# EasyEDA Pro project ProPrj_PDB-F800GS_2025-04-13.epro, board PCB1
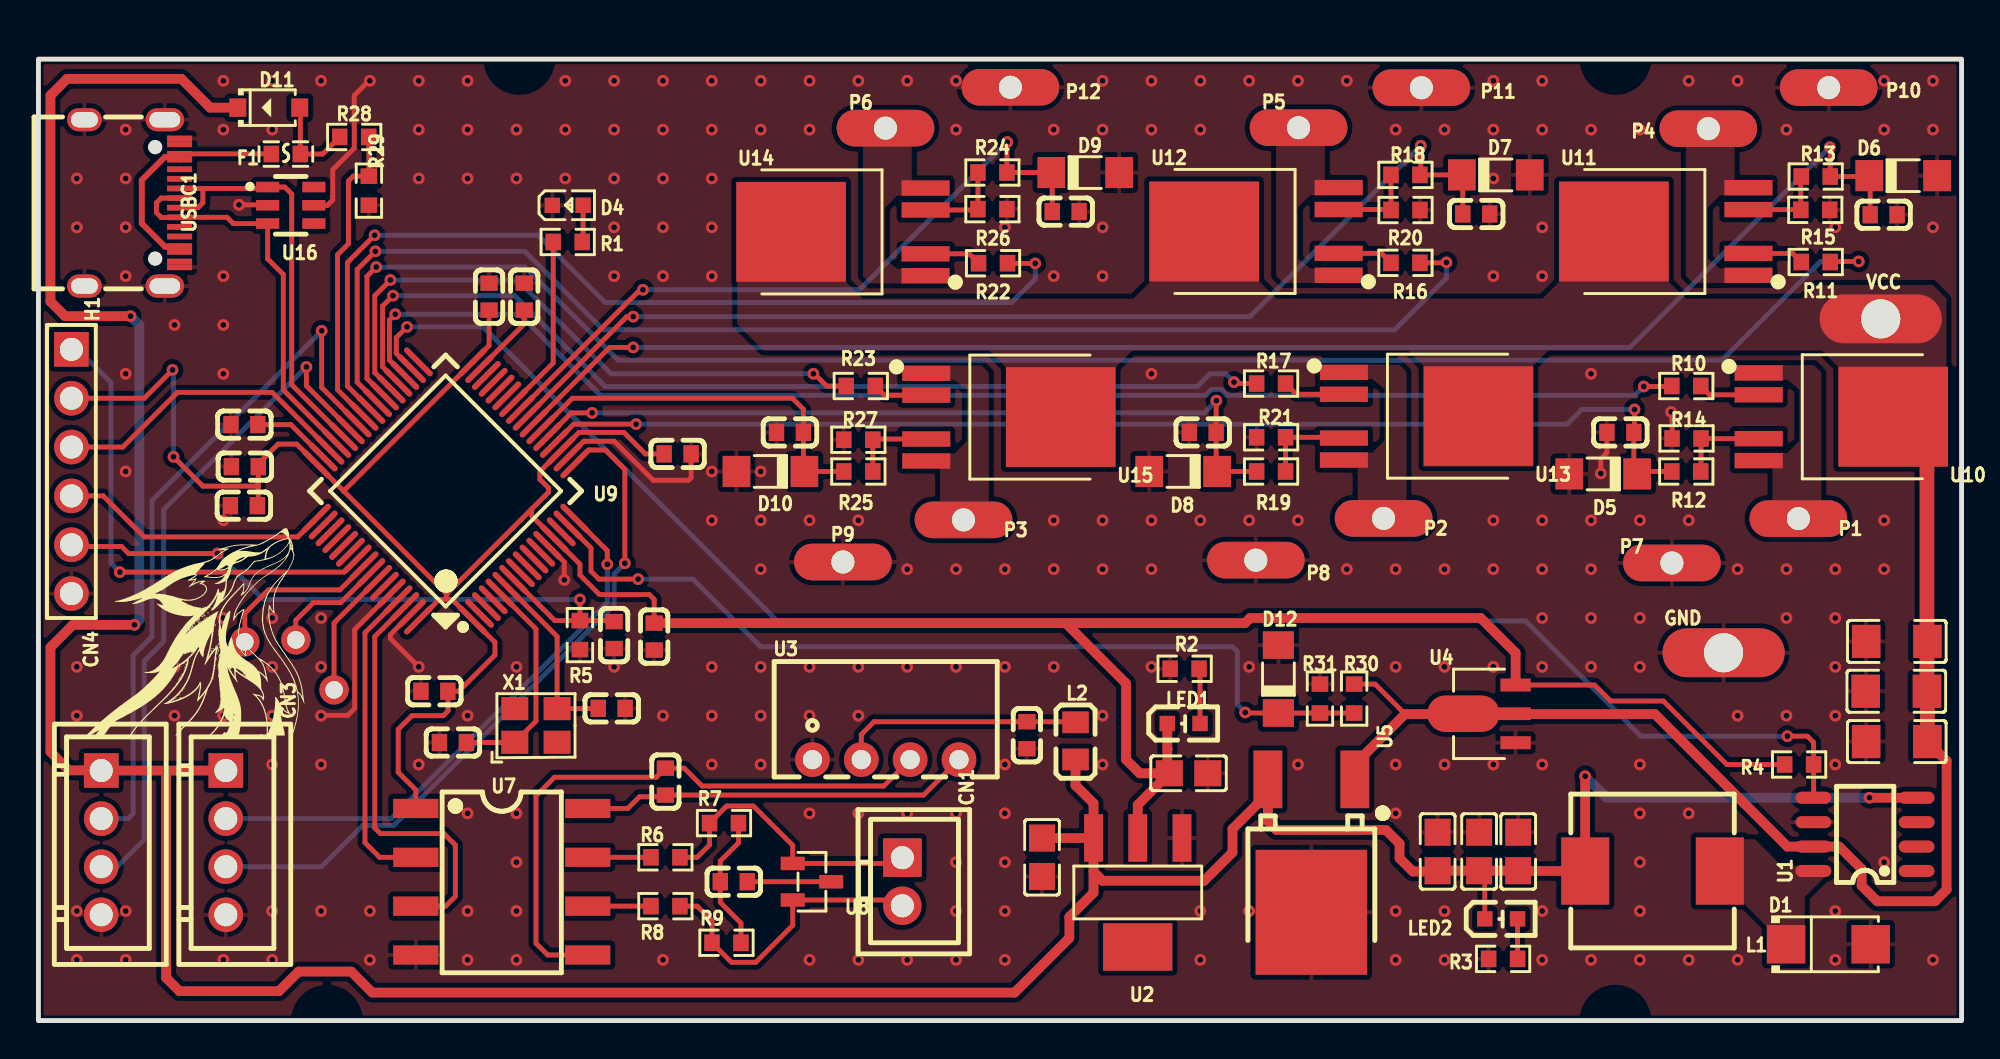
[diagram p3: board, top side]
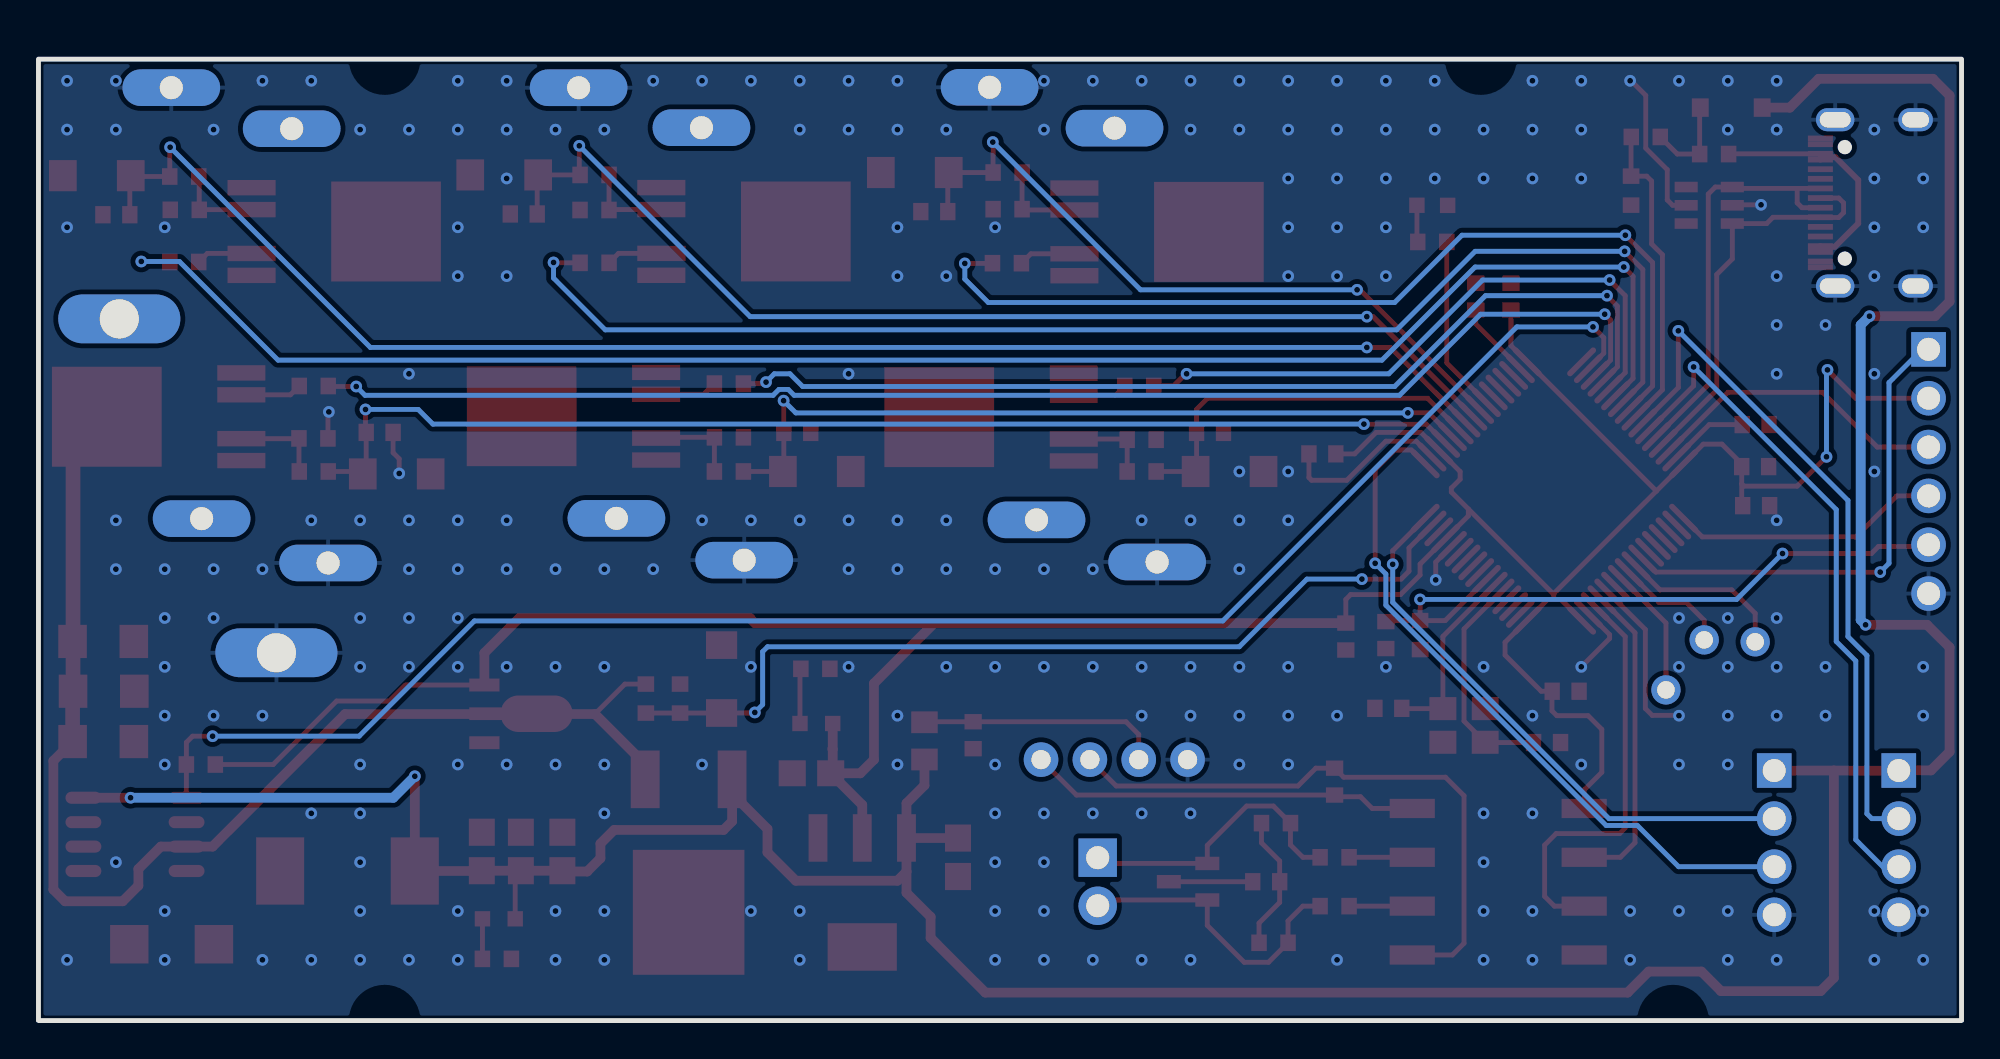
[diagram p4: board, bottom side, seen from below]

Outline 100 x 50 mm; copper layers: Top Layer, Bottom Layer. Coordinates in mm from the lower left corner of the outline.
Outline path: rectangle 0,50 100,0
Stack: Top Layer 0.035mm / Dielectric1 1.51mm FR4 er 4.5 / Bottom Layer 0.035mm

## Design rules (mm)
template: JLCPCB Capability(Two Layers Board)
spacing copperThickness1oz (default): track to track 0.102, other pairs 0.152 to 0.3
spacing copperThickness2oz: track to track 0.203, other pairs 0.152 to 0.3
track width copperThickness1oz (default): min 0.127, default 0.254, max 2.54
track width copperThickness2oz: min 0.203, default 0.254, max 2.54
differential pair differentialPair (default): width min 0.127, default 0.254, max 2.54; gap min 0.152, default 0.152
via viaSize (default): diameter min 0.5, default 0.61, max 10; hole min 0.3, default 0.305, max 6.3

## Placement (name value [footprint] x y rotation side)
C1  47uF  [C1206]  96.63 14.51 0 top
C2  47uF  [C0805]  76.95 8.79 270 top
C3  15pF  [C0603]  21.55 14.46 180 top
C4  47uF  [C0805]  74.91 8.79 270 top
C5  47uF  [C0805]  72.76 8.79 270 top
C6  47uF  [C1206]  96.61 17.13 0 top
C7  4.7uF  [C0603]  51.4 14.84 270 top
C8  4.7uF  [C0603]  32.6 12.43 270 top
C9  47uF  [C0805]  59.8 12.86 0 top
C10  47uF  [C0805]  52.18 8.49 90 top
C13  47uF  [C1206]  96.63 19.72 180 top
C14  15pF  [C0603]  29.81 16.24 0 top
C15  100nF  [C0603]  29.93 20.05 90 top
C16  2.2uF  [C0603]  10.71 30.99 180 top
C17  2.2uF  [C0603]  25.26 37.65 90 top
C18  100nF  [C0603]  36.16 7.22 0 top
C19  100nF  [C0603]  32.02 19.97 90 top
C20  100nF  [C0603]  10.68 26.78 0 top
C21  100nF  [C0603]  33.24 29.47 180 top
C22  100nF  [C0603]  10.73 28.81 0 top
C23  4.7uF  [C0603]  23.43 37.65 270 top
C24  1uF  [C0603]  20.59 17.13 0 top
C25  2.2pF  [C0603]  82.26 30.59 180 top
C26  2.2pF  [C0603]  95.95 41.91 0 top
C27  2.2pF  [C0603]  74.76 41.95 0 top
C28  2.2pF  [C0603]  60.54 30.59 180 top
C29  2.2pF  [C0603]  53.42 42.07 0 top
C30  2.2pF  [C0603]  39.08 30.59 180 top
CN1  XH-2A  [CONN-TH_XH-2A_C722856]  44.92 7.22 270 top
CN3  XH-4A  [CONN-TH_4P-P2.50_XH-4A]  9.74 9.25 270 top
CN4  XH-4A  [CONN-TH_4P-P2.50_XH-4A]  3.26 9.25 270 top
D1  SS34  [SMA_L4.3-W2.6-LS5.2-RD]  93.08 3.97 0 top
D4  XL-1608SURC-06  [LED0603-RD_RED]  27.52 42.4 0 top
D5  BZV55B3V3  [SOD-80_L3.5-W1.5-RD]  81.37 28.43 180 top
D6  BZV55B3V3  [SOD-80_L3.5-W1.5-RD]  96.97 43.94 0 top
D7  BZV55B3V3  [SOD-80_L3.5-W1.5-RD]  75.78 43.98 0 top
D8  BZV55B3V3  [SOD-80_L3.5-W1.5-RD]  59.53 28.56 180 top
D9  BZV55B3V3  [SOD-80_L3.5-W1.5-RD]  54.43 44.1 0 top
D10  BZV55B3V3  [SOD-80_L3.5-W1.5-RD]  38.06 28.56 180 top
D11  B5817W  [SOD-123_L2.7-W1.6-LS3.7-FD]  11.98 47.48 180 top
D12  BZV55B3V3  [SOD-80_L3.5-W1.5-RD]  64.48 17.76 90 top
F1  ASMD0603-020  [F0603]  12.86 45.07 180 top
GND  -  [Wire pad 2.54 x 6.35 footprint]  87.63 19.13 0 top
H1  2.54-1x6P直针  [HDR-TH_6P-P2.54-V-M-1]  1.71 28.56 270 top
L1  68uH  [IND-SMD_L8.5-W8.0_SMS0850]  83.93 7.78 180 top
L2  6.8uH  [L0805]  53.93 14.55 90 top
LED1  SZYY0603Y  [LED0603-R-RD_YELLOW]  59.55 15.45 0 top
LED2  SZYY0603Y  [LED0603-R-RD_YELLOW]  76.06 5.29 0 top
NOREF  -  [Pad_e208]  13.38 19.8 0 top
NOREF#2  -  [Pad_e216]  10.73 19.7 0 top
NOREF#3  -  [Pad_e213]  15.37 17.2 0 top
P1  -  [Wire pad 2x5 footprint]  91.52 26.1 180 top
P2  -  [Wire pad 2x5 footprint]  69.95 26.12 180 top
P3  -  [Wire pad 2x5 footprint]  48.1 26.04 180 top
P4  -  [Wire pad 2x5 footprint]  86.83 46.38 0 top
P5  -  [Wire pad 2x5 footprint]  65.52 46.44 0 top
P6  -  [Wire pad 2x5 footprint]  44.04 46.41 0 top
P7  -  [Wire pad 2x5 footprint]  84.94 23.8 180 top
P8  -  [Wire pad 2x5 footprint]  63.3 23.94 180 top
P9  -  [Wire pad 2x5 footprint]  41.83 23.85 180 top
P10  -  [Wire pad 2x5 footprint]  93.09 48.52 180 top
P11  -  [Wire pad 2x5 footprint]  71.91 48.51 180 top
P12  -  [Wire pad 2x5 footprint]  50.54 48.54 180 top
R1  4.7kΩ  [R0603]  27.52 40.49 180 top
R2  220Ω  [R0603]  59.6 18.29 0 top
R3  330Ω  [R0603]  76.16 3.21 0 top
R4  4.7kΩ  [R0603]  91.55 13.32 0 top
R5  10kΩ  [R0603]  28.16 20.05 90 top
R6  10Ω  [R0603]  32.6 8.49 0 top
R7  60.4Ω  [R0603]  35.65 10.27 0 top
R8  10Ω  [R0603]  32.6 5.95 0 top
R9  60.4Ω  [R0603]  35.78 4.04 0 top
R10  10kΩ  [R0603]  85.69 33 0 top
R11  10kΩ  [R0603]  92.42 39.45 180 top
R12  10kΩ  [R0603]  85.69 28.56 0 top
R13  10kΩ  [R0603]  92.42 43.9 180 top
R14  330Ω  [R0603]  85.7 30.28 0 top
R15  330Ω  [R0603]  92.39 42.16 180 top
R16  10kΩ  [R0603]  71.08 39.41 180 top
R17  10kΩ  [R0603]  64.1 33.13 0 top
R18  10kΩ  [R0603]  71.08 43.98 180 top
R19  10kΩ  [R0603]  64.1 28.56 0 top
R20  330Ω  [R0603]  71.09 42.16 180 top
R21  330Ω  [R0603]  64.1 30.33 0 top
R22  10kΩ  [R0603]  49.64 39.39 180 top
R23  10kΩ  [R0603]  42.76 33 0 top
R24  10kΩ  [R0603]  49.61 44.1 180 top
R25  10kΩ  [R0603]  42.63 28.56 0 top
R26  330Ω  [R0603]  49.61 42.2 180 top
R27  330Ω  [R0603]  42.63 30.21 0 top
R28  330Ω  [R0603]  16.42 45.95 0 top
R29  680Ω  [R0603]  17.18 43.16 270 top
R30  4.7kΩ  [R0603]  68.41 16.75 90 top
R31  1.3kΩ  [R0603]  66.64 16.75 270 top
U1  LM2594D-5.0RG  [SOP-8_L4.9-W3.9-P1.27-LS6.0-BL]  94.98 9.68 90 top
U2  AMS1117-3.3  [SOT-223-4_L6.5-W3.5-P2.30-LS7.0-BR]  57.16 6.66 90 top
U3  B0505S-1W  [PWRM-TH_BXXXXS-1WR3]  44.06 13.57 0 top
U4  HT7533-1  [SOT-89_L4.5-W2.5-P1.50-LS4.2-BR]  75.46 15.95 0 top
U5  CJ78M05  [TO-252-3_L6.5-W5.8-P4.58-TL]  66.19 9.09 270 top
U7  ISO1050DUBR  [SOIC-8_L9.3-W6.6-P2.54-LS10.4-BL]  24.09 7.22 270 top
U8  CDSOT23-SM712  [SOT-23-3_L2.9-W1.3-P0.95-LS2.4-BR]  40.22 7.22 180 top
U9  STM32F405RGT6  [LQFP-64_L10.0-W10.0-P0.50-LS12.0-BL]  21.17 27.54 45 top
U10  BTS6143D  [TO-252-5_L6.5-W6.1-P1.14-LS10.0-BR]  92.95 31.4 180 top
U11  BTS6143D  [TO-252-5_L6.5-W6.1-P1.14-LS10.0-BR]  85.42 41.04 0 top
U12  BTS6143D  [TO-252-5_L6.5-W6.1-P1.14-LS10.0-BR]  64.11 41.04 0 top
U13  BTS6143D  [TO-252-5_L6.5-W6.1-P1.14-LS10.0-BR]  71.38 31.43 180 top
U14  BTS6143D  [TO-252-5_L6.5-W6.1-P1.14-LS10.0-BR]  42.63 41.02 0 top
U15  BTS6143D  [TO-252-5_L6.5-W6.1-P1.14-LS10.0-BR]  49.66 31.38 180 top
U16  TPESDA6V1BC6  [TSOT-23-6_L2.9-W1.6-P0.95-LS2.8-BL]  13.12 42.4 270 top
USBC1  TYPE-C-31-M-12  [USB-C_SMD-TYPE-C-31-M-12]  4.86 42.53 270 top
VCC  -  [Wire pad 2.54 x 6.35 footprint]  95.8 36.49 0 top
X1  8MHz  [OSC-SMD_4P-L3.2-W2.5-BL]  25.87 15.35 0 top

## Footprints (pads in the part's own frame, mm; a bottom-side part is the same pattern mirrored in y, then rotated)
C0603
  rect 0.8x0.9 smd: 1(-0.7,0) 2(0.7,0)
C0805
  rect 1.41x1.35 smd: 1(-1,0) 2(1,0)
C1206
  rect 1.485x1.728 smd: 1(-1.593,0) 2(1.593,0)
CONN-TH_4P-P2.50_XH-4A
  rect 1.8x1.8 hole 1.199: 1(-3.751,0)
  round 1.8 hole 1.199: 2(-1.25,0) 3(1.25,0) 4(3.751,0)
CONN-TH_XH-2A_C722856
  rect 2x2 hole 1.2: 1(-1.25,0)
  round 2 hole 1.2: 2(1.25,0)
F0603
  rect 0.806x0.864 smd: 1(-0.753,0) 2(0.753,0)
HDR-TH_6P-P2.54-V-M-1
  rect 1.8x1.8 hole 1.2x0.9: 1(-6.35,0)
  round 1.8 hole 1.2x0.9: 2(-3.81,0) 3(-1.27,0) 4(1.27,0) 5(3.81,0) 6(6.35,0)
IND-SMD_L8.5-W8.0_SMS0850
  rect 2.5x3.5 smd: 1(-3.5,0) 2(3.5,0)
L0805
  rect 1.133x1.377 smd: 1(-0.966,0) 2(0.966,0)
LED0603-R-RD_YELLOW
  rect 0.8x0.8 smd: 1(0.851,0) 2(-0.851,0)
LED0603-RD_RED
  rect 0.8x0.8 smd: 1(-0.799,-0.004) 2(0.799,0.004)
LQFP-64_L10.0-W10.0-P0.50-LS12.0-BL
  oval 0.3x2 smd: 1(-3.75,-5.75) 2(-3.25,-5.75) 3(-2.75,-5.75) 4(-2.25,-5.75) 5(-1.75,-5.75) 6(-1.25,-5.75) 7(-0.75,-5.75) 8(-0.25,-5.75) 9(0.25,-5.75) 10(0.75,-5.75) 11(1.25,-5.75) 12(1.75,-5.75) 13(2.25,-5.75) 14(2.75,-5.75) 15(3.25,-5.75) 16(3.75,-5.75) 33(3.75,5.75) 34(3.25,5.75) 35(2.75,5.75) 36(2.25,5.75) 37(1.75,5.75) 38(1.25,5.75) 39(0.75,5.75) 40(0.25,5.75) 41(-0.25,5.75) 42(-0.75,5.75) 43(-1.25,5.75) 44(-1.75,5.75) 45(-2.25,5.75) 46(-2.75,5.75) 47(-3.25,5.75) 48(-3.75,5.75)
  oval 2x0.3 smd: 17(5.75,-3.75) 18(5.75,-3.25) 19(5.75,-2.75) 20(5.75,-2.25) 21(5.75,-1.75) 22(5.75,-1.25) 23(5.75,-0.75) 24(5.75,-0.25) 25(5.75,0.25) 26(5.75,0.75) 27(5.75,1.25) 28(5.75,1.75) 29(5.75,2.25) 30(5.75,2.75) 31(5.75,3.25) 32(5.75,3.75) 49(-5.75,3.75) 50(-5.75,3.25) 51(-5.75,2.75) 52(-5.75,2.25) 53(-5.75,1.75) 54(-5.75,1.25) 55(-5.75,0.75) 56(-5.75,0.25) 57(-5.75,-0.25) 58(-5.75,-0.75) 59(-5.75,-1.25) 60(-5.75,-1.75) 61(-5.75,-2.25) 62(-5.75,-2.75) 63(-5.75,-3.25) 64(-5.75,-3.75)
OSC-SMD_4P-L3.2-W2.5-BL
  rect 1.4x1.2 smd: 1(-1.1,-0.875) 2(1.1,-0.875) 3(1.1,0.875) 4(-1.1,0.875)
Pad_e208
  round 1.524 hole 0.914: 1(0,0)
Pad_e213
  round 1.524 hole 0.914: 2(0,0)
Pad_e216
  round 1.524 hole 0.914: 3(0,0)
PWRM-TH_BXXXXS-1WR3
  round 1.8 hole 1: 1(-3.81,0) 2(-1.27,0) 3(1.27,0) 4(3.81,0)
R0603
  rect 0.806x0.864 smd: 1(-0.753,0) 2(0.753,0)
SMA_L4.3-W2.6-LS5.2-RD
  rect 2x2 smd: 1(-2.2,0) 2(2.2,0)
SOD-80_L3.5-W1.5-RD
  rect 1.44x1.62 smd: 1(-1.765,0) 2(1.765,0)
SOD-123_L2.7-W1.6-LS3.7-FD
  rect 0.88x0.96 smd: 1(-1.61,0) 2(1.61,0)
SOIC-8_L9.3-W6.6-P2.54-LS10.4-BL
  rect 1x2.35 smd: 1(-3.81,-4.471) 2(-1.27,-4.471) 3(1.27,-4.471) 4(3.81,-4.471) 5(3.81,4.471) 6(1.27,4.471) 7(-1.27,4.471) 8(-3.81,4.471)
SOP-8_L4.9-W3.9-P1.27-LS6.0-BL
  oval 0.63x1.865 smd: 1(-1.905,-2.683) 2(-0.635,-2.683) 3(0.635,-2.683) 4(1.905,-2.683) 5(1.905,2.683) 6(0.635,2.683) 7(-0.635,2.683) 8(-1.905,2.683)
SOT-23-3_L2.9-W1.3-P0.95-LS2.4-BR
  rect 1.25x0.7 smd: 1(1,-0.95) 2(1,0.95) 3(-1,0)
SOT-89_L4.5-W2.5-P1.50-LS4.2-BR
  rect 1.575x0.672 smd: 1(1.356,-1.5) 3(1.356,1.5)
  custom 5.377x1.9 smd: 2(-1.356,0.009)
SOT-223-4_L6.5-W3.5-P2.30-LS7.0-BR
  rect 2.47x0.98 smd: 1(2.835,-2.3) 2(2.835,0) 3(2.835,2.3)
  rect 2.47x3.6 smd: 4(-2.835,0)
TO-252-3_L6.5-W5.8-P4.58-TL
  rect 3x1.5 smd: 1(-3.457,2.26) 3(-3.457,-2.26)
  rect 6.5x5.8 smd: 2(3.457,0)
TO-252-5_L6.5-W6.1-P1.14-LS10.0-BR
  rect 2.5x0.8 smd: 1(3.497,-2.28) 2(3.497,-1.14) 4(3.497,1.14) 5(3.497,2.28)
  rect 5.704x5.2 smd: 6(-3.497,0)
TSOT-23-6_L2.9-W1.6-P0.95-LS2.8-BL
  rect 0.55x1.2 smd: 1(-0.95,-1.2) 2(0,-1.2) 3(0.95,-1.2) 4(0.95,1.2) 5(0,1.2) 6(-0.95,1.2)
USB-C_SMD-TYPE-C-31-M-12
  oval 1.2x2 hole 0.8x1.6: 0(-4.325,1.706) 1(4.325,1.706)
  oval 1.2x1.8 hole 0.8x1.4: 2(4.325,-2.474) 3(-4.325,-2.474)
  rect 0.3x1.3 smd: A1(-3.35,2.474) A4(-2.55,2.474) A5(-1.25,2.474) A6(-0.25,2.474) A7(0.25,2.474) A8(1.25,2.474) A9(2.55,2.474) A12(3.35,2.474) B1(3.05,2.474) B4(2.25,2.474) B5(1.75,2.474) B6(0.75,2.474) B7(-0.75,2.474) B8(-1.75,2.474) B9(-2.25,2.474) B12(-3.05,2.474)
Wire pad 2.54 x 6.35 footprint
  oval 6.35x2.54 hole 2.032x1.905: 1(0,0)
Wire pad 2x5 footprint
  oval 5.08x1.905 hole 1.2: 1(0,0)

## Nets
As in the schematic, except:
+3V3: C9.1 C19.2 C20.2 C21.2 C22.2 C23.2 C24.2 H1.2 LED1.2 R4.1 U2.2 U4.3 U7.1 U9.1 U9.13 U9.19 U9.32 U9.48 U9.64

Pads without a net: NOREF 1; NOREF#2 3; NOREF#3 2; U1 1 2 3; U2 4; U9 2 3 4 8 9 10 11 14 27 28 29 30 33 50 51 52 53 54 56 57 58 59; U16 4 6; USBC1 A5 A8 B5 B8; X1 2 4

## Via types
v1: diameter 0.61, hole 0.305, Top Layer to Bottom Layer, 284 vias

## Routing (per net, layer and track width the routed paths; a pad name or vN(x,y) marks a point on that pad's centre or on a via; arc(x,y) is an arc through that point)
+3V3: length 168.6
  Top Layer w0.254: 25.65,26.61 26.53,27.49 26.53,27.69 26.07,28.15 26.07,28.55 27.18,29.66 28.11,30.59 30.44,30.59 31.56,29.47 C21.2 ; 25.65,26.61 25.65,26.25 26.83,25.06 28.16,23.74 28.16,23.17 29.17,22.16 31.76,22.16 32.02,21.9 C19.2 ; 25.65,26.61 21.21,22.17 ; 15.87,27.54 21.21,22.2 21.21,22.17 ; 15.87,27.54 U9.48 13.43,29.98 12.46,29.98 11.43,28.95 C22.2 11.43,27.91 ; 15.87,27.54 15.87,27.54 22.58,34.26 23.43,35.1 23.43,36.49 ; 11.43,27.91 11.43,26.83 C20.2 ; 11.43,27.91 11.32,27.79 8.55,27.79 v1(7.02,29.32) ; H1.2 5.5,32.37 v1(6.97,33.84) ; U4.3 80.92,17.45 81.75,16.62 84.49,16.62 87.79,13.32 R4.1 ; 21.21,22.17 21.21,21.9 ; U7.1 19.62,12 18.71,12.91 18.71,15.14 19.42,15.86 21.04,15.86 21.3,16.11 21.3,17.11 C24.2 21.86,17.13 23.74,19.01 23.74,19.67 21.51,21.9 21.21,21.9 ; U9.64 20.84,21.9 21.21,21.9
  Top Layer w0.508: 58.7,14.11 58.72,14.13 ; 58.7,14.11 58.7,12.96 C9.1 ; 58.7,14.11 LED1.2 ; U4.3 76.81,19.12 74.99,20.94 63,20.94 62.74,20.67 53.41,20.67 ; C9.1 57.16,11.22 U2.2 ; C9.1 57.26,12.86 56.55,13.57 56.55,17.53 53.41,20.67 ; 53.41,20.67 C19.2
  Bottom Layer w0.254: v1(6.97,33.84) 7.02,33.79 v1(7.02,29.32)
+5V: length 192.4
  Top Layer w0.254: LED2.2 75.21,7.5 C4.2
  Top Layer w0.508: 63.93,11.8 63.93,10.36 64.38,9.91 70.07,9.91 70.78,9.2 70.78,8.44 71.47,7.75 72.71,7.75 C5.2 C4.2 C2.2 76.96,7.78 L1.2 80.43,7.78 v1(80.43,12.71) ; 63.93,11.8 62.09,9.96 62.09,8.74 60.62,7.27 55.33,7.27 54.86,7.74 ; 63.93,11.8 U5.3 ; U1.4 v1(95.21,11.59) ; 53.93,13.58 53.93,12.23 54.86,11.3 U2.3 ; 6.64,13 CN3.1 ; 6.64,13 CN4.1 3.25,13.01 1.59,13.01 0.62,13.98 0.62,19.41 1.79,20.58 v1(4.99,20.58) ; 6.64,13 6.64,2.22 7.33,1.53 12.51,1.53 13.53,2.55 16.27,2.55 17.36,1.45 50.76,1.45 53.61,4.3 53.61,5.39 54.86,6.65 54.86,7.74 ; C10.2 54.86,9.49 U2.3 ; 54.86,7.74 U2.3 ; v1(4.79,36.63) 1.38,36.63 0.62,37.39 0.62,48.11 1.49,48.98 7.43,48.98 8.93,47.48 D11.2
  Bottom Layer w0.508: v1(4.79,36.63) 5.25,36.18 5.25,20.83 v1(4.99,20.58) ; v1(95.21,11.59) 81.55,11.59 v1(80.43,12.71)
+5V_ISOL: length 20.4
  Top Layer w0.254: U3.4 46.02,11.73 C8.2 32.51,11.64 31.25,11.64 30.65,11.03 U7.8
GND: length 36.9
  Top Layer w0.254: U16.2 11.89,42.42 v1(10.43,42.42) ; C21.1 33.94,28.24 33.79,28.1 31.97,28.1 29.93,30.13 28.36,30.13 27.53,29.31 ; C25.2 81.56,29.53 81.24,29.22 v1(81.24,28.45) ; R14.1 84.95,31.61 v1(84.9,31.66) ; v1(19.77,18.4) 18.3,19.87 18.3,20.07 U9.63 ; U16.5 15.02,42.4 15.3,42.68 15.3,44.25 16.42,45.37 16.42,48.11 17.18,48.88 v1(17.23,48.88) ; v1(27.34,22.92) 27.34,23.84 U9.12 ; v1(14.69,15.86) 14.71,15.87 16.08,15.87 16.44,16.23 16.44,20.34 18.34,22.24
  vias: v1(1.99,43.8) v1(1.99,41.26) v1(1.99,18.4) v1(1.99,15.86) v1(1.99,5.7) v1(1.99,3.16) v1(4.53,46.34) v1(4.53,43.8) v1(4.53,41.26) v1(4.53,38.72) v1(4.53,33.64) v1(4.53,28.56) v1(4.53,5.7) v1(4.53,3.16) v1(7.07,36.18) v1(7.07,18.4) v1(7.07,15.86) v1(9.61,48.88) v1(9.61,46.34) v1(9.61,38.72) v1(9.61,36.18) v1(9.61,33.64) v1(9.61,26.02) v1(9.61,20.94) v1(9.61,18.4) v1(9.61,15.86) v1(9.61,3.16) v1(12.15,48.88) v1(12.15,46.34) v1(12.15,20.94) v1(12.15,18.4) v1(12.15,15.86) v1(12.15,13.32) v1(12.15,5.7) v1(12.15,3.16) v1(14.69,48.88) v1(14.69,20.94) v1(14.69,18.4) v1(14.69,13.32) v1(14.69,5.7) v1(17.23,5.7) v1(17.23,3.16) v1(19.77,48.88) v1(19.77,46.34) v1(19.77,43.8) v1(19.77,13.32) v1(22.31,48.88) v1(22.31,46.34) v1(22.31,43.8) v1(22.31,15.86) v1(22.31,10.78) v1(22.31,5.7) v1(22.31,3.16) v1(24.85,46.34) v1(24.85,43.8) v1(24.85,18.4) v1(24.85,10.78) v1(24.85,8.24) v1(24.85,5.7) v1(24.85,3.16) v1(27.39,48.88) v1(27.39,46.34) v1(27.39,43.8) v1(29.93,48.88) v1(29.93,46.34) v1(29.93,43.8) v1(29.93,41.26) v1(29.93,38.72) v1(29.93,18.4) v1(32.47,48.88) v1(32.47,46.34) v1(32.47,43.8) v1(32.47,41.26) v1(32.47,38.72) v1(32.47,15.86) v1(32.47,3.16) v1(35.01,48.88) v1(35.01,46.34) v1(35.01,43.8) v1(35.01,41.26) v1(35.01,38.72) v1(35.01,28.56) v1(35.01,26.02) v1(35.01,18.4) v1(35.01,15.86) v1(35.01,13.32) v1(37.55,48.88) v1(37.55,46.34) v1(37.55,28.56) v1(37.55,26.02) v1(37.55,23.48) v1(37.55,18.4) v1(37.55,15.86) v1(37.55,13.32) v1(40.09,48.88) v1(40.09,46.34) v1(40.09,26.02) v1(40.09,18.4) v1(40.09,15.86) v1(40.09,10.78) v1(40.09,3.16) v1(42.63,48.88) v1(42.63,26.02) v1(42.63,18.4) v1(42.63,15.86) v1(42.63,10.78) v1(42.63,3.16) v1(45.17,48.88) v1(45.17,23.48) v1(45.17,18.4) v1(45.17,10.78) v1(45.17,3.16) v1(47.71,48.88) v1(47.71,46.34) v1(47.71,23.48) v1(47.71,18.4) v1(47.71,10.78) v1(47.71,8.24) v1(47.71,5.7) v1(47.71,3.16) v1(50.25,41.26) v1(50.25,23.48) v1(50.25,18.4) v1(50.25,13.32) v1(50.25,10.78) v1(50.25,8.24) v1(50.25,5.7) v1(50.25,3.16) v1(52.79,46.34) v1(52.79,38.72) v1(52.79,26.02) v1(52.79,23.48) v1(52.79,18.4) v1(55.33,48.88) v1(55.33,46.34) v1(55.33,41.26) v1(55.33,38.72) v1(55.33,26.02) v1(55.33,23.48) v1(55.33,15.86) v1(55.33,13.32) v1(57.87,48.88) v1(57.87,46.34) v1(57.87,33.64) v1(57.87,26.02) v1(57.87,23.48) v1(57.87,18.4) v1(60.41,48.88) v1(60.41,46.34) v1(60.41,26.02) v1(60.41,5.7) v1(60.41,3.16) v1(62.95,48.88) v1(62.95,26.02) v1(62.95,18.4) v1(62.95,5.7) v1(65.49,48.88) v1(65.49,26.02) v1(65.49,13.32) v1(68.03,48.88) v1(68.03,23.48) v1(70.57,46.34) v1(70.57,23.48) v1(70.57,18.4) v1(70.57,13.32) v1(70.57,10.78) v1(70.57,5.7) v1(70.57,3.16) v1(73.11,46.34) v1(73.11,23.48) v1(73.11,18.4) v1(73.11,13.32) v1(73.11,5.7) v1(73.11,3.16) v1(75.65,48.88) v1(75.65,46.34) v1(75.65,43.8) v1(75.65,38.72) v1(75.65,26.02) v1(75.65,23.48) v1(75.65,18.4) v1(75.65,13.32) v1(78.19,48.88) v1(78.19,46.34) v1(78.19,41.26) v1(78.19,38.72) v1(78.19,26.02) v1(78.19,23.48) v1(78.19,20.94) v1(78.19,18.4) v1(78.19,13.32) v1(78.19,5.7) v1(78.19,3.16) v1(80.73,46.34) v1(80.73,33.64) v1(80.73,26.02) v1(80.73,23.48) v1(80.73,20.94) v1(80.73,18.4) v1(80.73,3.16) v1(83.27,46.34) v1(83.27,26.02) v1(83.27,20.94) v1(83.27,18.4) v1(83.27,13.32) v1(83.27,10.78) v1(83.27,8.24) v1(83.27,5.7) v1(83.27,3.16) v1(85.81,48.88) v1(85.81,26.02) v1(85.81,10.78) v1(85.81,3.16) v1(88.35,48.88) v1(88.35,23.48) v1(88.35,15.86) v1(88.35,3.16) v1(90.89,46.34) v1(90.89,23.48) v1(90.89,20.94) v1(90.89,15.86) v1(93.43,41.26) v1(93.43,23.48) v1(93.43,20.94) v1(93.43,18.4) v1(93.43,15.86) v1(93.43,13.32) v1(93.43,5.7) v1(93.43,3.16) v1(95.97,48.88) v1(95.97,46.34) v1(95.97,26.02) v1(95.97,23.48) v1(95.97,8.24) v1(98.51,48.88) v1(98.51,46.34) v1(98.51,41.26) v1(98.51,3.16)
GND_ISOL2: length 4.4
  Top Layer w0.254: C18.2 41.09,7.22 41.22,7.09
PGND: length 31.6
  Top Layer w0.254: U3.3 43.96,12.2 34.51,12.2 33.58,13.13 C8.1 32.13,12.66 26.83,12.66 25.87,11.69 25.87,4.02 26.48,3.41 U7.5
VCC: length 66.5
  Top Layer w0.254: R30.2 69.51,17.5 71.06,15.94
  Top Layer w0.508: C1.2 99.22,13.51 99.22,6.81 98.62,6.2 95.62,6.2 94.81,7.02 94.81,7.88 93.64,9.05 U1.7 90.95,9.05 84.05,15.94 71.06,15.94 68.45,13.33 U5.1
  Top Layer w0.762: 96.45,31.4 98.2,29.65 C6.2 98.22,17.1 C1.2
(no net): length 21.3
  Top Layer w0.254: U9.58 15.37,20.68 NOREF#3.2 ; U9.57 15.72,21.74 14.3,21.74 13.38,20.82 NOREF.1 ; NOREF#2.3 10.73,21.17 11.95,22.4 15.68,22.4 16.93,23.65
ADC_VCC: length 47.3
  Top Layer w0.254: v1(31.18,22.96) 29.14,22.96 28.73,23.37 28.73,24.57 27.53,25.77 ; R30.1 R31.2 64.48,15.99 D12.1 62.78,16 v1(62.75,16.02)
  Bottom Layer w0.254: v1(31.18,22.96) 34.04,22.96 37.56,19.44 62.09,19.44 62.34,19.19 62.34,16.43 v1(62.75,16.02)
CAN1_H: length 15.2
  Top Layer w0.254: 44.92,8.34 44.75,8.17 U8.1 39.22,9.11 37.17,11.16 35.78,11.16 R7.1 34.9,9.13 34.25,8.49 R6.2
CAN1_L: length 15.6
  Top Layer w0.254: R8.2 34.25,5.95 35.02,5.18 R9.1 36.04,3.03 37.3,3.03 39.22,4.95 39.22,6.14 ; 44.92,5.84 44.49,6.27 U8.2
CAN1_RX: length 16.3
  Top Layer w0.254: U9.61 16.98,20.17 16.98,9.25 17.74,8.49 U7.2
CAN1_TX: length 21.7
  Top Layer w0.254: U7.3 21.17,5.95 21.68,6.46 21.68,9.12 21.08,9.73 17.78,9.73 17.49,10.01 17.49,19.97 U9.62
F_SWCLK: length 14.1
  Top Layer w0.254: U9.49 13.48,25.15 5.5,25.15 3.37,27.29 1.61,27.29
F_SWDIO: length 16
  Top Layer w0.254: 15.16,29.66 12.15,32.67 7.23,32.67 4.38,29.83 1.61,29.83
F_SWO: length 25.5
  Top Layer w0.254: v1(4.23,23.32) 15.89,23.32 16.58,24
  Bottom Layer w0.254: v1(4.23,23.32) 3.77,23.78 3.77,33.18 2.05,34.91 1.61,34.91
IN_1: length 72.2
  Top Layer w0.254: v1(18.56,36.73) 18.25,36.43 18.25,34.35 U9.35 ; v1(83.48,32.98) 84.91,32.98 R10.1
  Bottom Layer w0.254: v1(18.56,36.73) 25.01,36.73 29.22,32.52 60.71,32.52 61.01,32.82 61.49,32.82 61.8,32.52 83.02,32.52 v1(83.48,32.98)
IN_2: length 52.4
  Top Layer w0.254: U9.36 17.89,34 17.89,37.16 v1(18.44,37.7) ; R17.1 62.24,33.13 v1(62.17,33.2)
  Bottom Layer w0.254: v1(18.44,37.7) 24.75,37.7 29.48,32.98 60.26,32.98 60.92,33.64 61.74,33.64 v1(62.17,33.2)
IN_3: length 32.4
  Top Layer w0.254: 18.34,32.84 17.49,33.7 17.49,37.7 v1(18.3,38.51) ; R23.1 40.98,33 40.35,33.64 v1(40.3,33.64)
  Bottom Layer w0.254: v1(40.3,33.64) 29.78,33.64 24.91,38.51 v1(18.3,38.51)
IN_4: length 90
  Top Layer w0.254: v1(94.65,39.48) 93.2,39.48 R11.1 ; v1(17.56,39.19) 17.08,38.71 17.08,33.4 17.99,32.49
  Bottom Layer w0.254: v1(94.65,39.48) 92.67,39.48 87.54,34.35 30.14,34.35 25.3,39.19 v1(17.56,39.19)
IN_5: length 69.4
  Top Layer w0.254: U9.39 16.57,33.2 16.57,39.06 v1(17.52,40.01) ; R16.1 73.2,39.41 v1(73.22,39.43)
  Bottom Layer w0.254: v1(73.22,39.43) 73.22,38.61 70.52,35.92 29.38,35.92 25.29,40.01 v1(17.52,40.01)
IN_6: length 48.7
  Top Layer w0.254: v1(17.48,40.84) 16.07,39.43 16.07,33 U9.40 ; R22.1 50.4,39.38 v1(51.83,39.38)
  Bottom Layer w0.254: v1(17.48,40.84) 25.98,40.84 29.48,37.34 50.61,37.34 51.83,38.56 v1(51.83,39.38)
IS_1: length 62.1
  Top Layer w0.254: v1(31.08,31.02) 27.83,31.02 26.83,30.02 ; R12.1 83.01,28.56 82.96,28.61 C25.1 82.99,30.62 v1(82.99,31.78)
  Bottom Layer w0.254: v1(82.99,31.78) 80.25,31.78 79.49,31.02 v1(31.08,31.02)
IS_2: length 41.2
  Top Layer w0.254: U9.21 27.71,31.6 v1(28.79,31.6) ; v1(61.25,32.24) 61.24,32.23 C28.1 61.24,28.61 ; R19.1 D8.1
  Bottom Layer w0.254: v1(61.25,32.24) 60.62,31.6 v1(28.79,31.6)
IS_3: length 19.9
  Top Layer w0.254: U9.22 27.76,32.37 39.21,32.37 39.78,31.79 C30.1 39.78,28.61 D10.1 R25.1
IS_4: length 79
  Top Layer w0.254: C26.1 95.25,43.89 D6.1 95.16,43.9 R13.1 93.17,45.4 v1(93.15,45.42) ; v1(30.92,35.01) 29.7,35.01 U9.23
  Bottom Layer w0.254: v1(30.92,35.01) 82.74,35.01 v1(93.15,45.42)
IS_5: length 58.1
  Top Layer w0.254: 25.41,31.43 30.59,36.61 v1(30.92,36.61) ; v1(71.88,45.49) 71.88,44.02 R18.1 D7.1 74.06,43.93 C27.1
  Bottom Layer w0.254: v1(71.88,45.49) 62.99,36.61 v1(30.92,36.61)
IS_6: length 37
  Top Layer w0.254: v1(31.43,38) 31.28,38 U9.25 ; v1(50.38,45.69) 50.36,45.67 R24.1 D9.1 52.72,44.06 C29.1
  Bottom Layer w0.254: v1(31.43,38) 42.69,38 v1(50.38,45.69)
LM_EN: length 87.7
  Top Layer w0.254: v1(90.94,14.79) 91.98,14.79 92.31,14.47 R4.2 92.31,11.6 U1.5 ; U9.34 18.61,34.7 18.61,35.52 v1(19.16,36.07)
  Bottom Layer w0.254: v1(90.94,14.79) 83.32,14.79 77.33,20.78 38.42,20.78 23.13,36.07 v1(19.16,36.07)
NRST: length 34.6
  Top Layer w0.254: R5.2 29.5,20.8 29.55,20.75 ; R5.2 v1(28.16,21.9) ; R5.2 26.85,20.8 U9.7 ; 1.61,24.75 1.71,24.65 4.32,24.65 4.69,24.29 v1(9.31,24.29)
  Bottom Layer w0.254: v1(28.16,21.9) 11.7,21.9 v1(9.31,24.29)
USART1_RX: length 35.2
  Top Layer w0.254: v1(13.93,33.99) 13.93,33.01 U9.43
  Bottom Layer w0.254: CN4.3 3.42,7.85 3.94,7.85 5.5,9.41 5.5,18.7 6.52,19.72 6.52,26.58 v1(13.93,33.99)
USART1_TX: length 36.5
  Top Layer w0.254: v1(14.73,35.87) 14.73,32.92 16.58,31.08
  Bottom Layer w0.254: v1(14.73,35.87) 5.91,27.05 5.91,19.97 4.92,18.99 4.92,10.76 4.67,10.5 CN4.2
USART2_RX: length 36.4
  Top Layer w0.254: v1(30.49,23.78) 30.49,28.66 29.48,29.67 28.61,29.67 U9.17
  Bottom Layer w0.254: CN3.3 14.71,8 16.86,10.15 18.48,10.15 29.93,21.6 29.93,23.22 v1(30.49,23.78)
USART2_TX: length 29.6
  Top Layer w0.254: v1(29.58,23.73) 29.58,24.44 U9.16
  Bottom Layer w0.254: v1(29.58,23.73) 29.58,21.75 18.33,10.5 CN3.2
USB_OTG_FS_DM: length 21.8
  Top Layer w0.254: USBC1.B7 8.55,43.28 ; 8.55,43.28 8.55,43.27 8.55,42.53 8.3,42.28 USBC1.A7 ; 8.55,43.28 11.85,43.28 U16.1 12.8,43.35 13.17,42.98 13.17,33.07 U9.44
USB_OTG_FS_DP: length 20.8
  Top Layer w0.254: 15.51,30.02 12.73,32.8 12.73,38.8 11.92,39.61 U16.3 10.13,41.45 9.81,41.78 USBC1.B6 7.33,41.76 6.39,41.76 6.13,42.02 6.13,42.53 6.38,42.78 USBC1.A6
USB_OTG_VBUS: length 16.2
  Top Layer w0.254: R28.2 17.18,45.95 R29.1 16.37,43.91 16.12,43.66 16.12,40.39 15.55,39.83 15.55,32.8 16.93,31.43
$1N2118: length 2.1
  Top Layer w0.254: LED2.1 76.91,3.21 R3.2
$1N2161: length 2.9
  Top Layer w0.254: R2.2 60.4,18.25 LED1.1
$1N2679: length 12.7
  Top Layer w0.254: L2.2 53.9,15.54 C7.1 43.45,15.54 42.79,14.88 U3.2
$2N1672: length 4.1
  Top Layer w0.254: U9.47 13.12,30.99 C16.1
$2N1673: length 3.5
  Top Layer w0.254: 25.26,36.49 25.26,36.23 U9.31
$2N1688: length 7.2
  Top Layer w0.254: 36.4,10.39 36.4,9.24 35.46,8.3 35.46,6.14 36.53,5.07 R9.2
$2N1692: length 3.3
  Top Layer w0.254: U7.7 R6.1
$2N1693: length 3.3
  Top Layer w0.254: R8.1 U7.6
$2N1694: length 11.5
  Top Layer w0.254: C3.1 24.76,14.46 X1.1 25.87,15.57 25.87,20.37 U9.5
$2N1695: length 9.6
  Top Layer w0.254: C14.1 29.09,16.22 X1.3 26.97,19.97 U9.6
$2N1698: length 1.9
  Top Layer w0.254: D4.2 28.32,40.54 R1.1
$2N1700: length 9.2
  Top Layer w0.254: R1.2 26.77,34.2 U9.26
$2N3193: length 12.6
  Top Layer w0.254: USBC1.A9 USBC1.B4 ; F1.2 12.1,45.08 USBC1.A4 USBC1.B9
  Top Layer w0.305: USBC1.B4 7.3,40.24 6.59,40.24 5.37,41.46 5.37,43.71 6.56,44.9 7.21,44.9 USBC1.B9
$2N3573: length 4.8
  Top Layer w0.254: R28.1 14.78,45.07 F1.1 13.62,47.45 D11.1
$3N493: length 4.7
  Top Layer w0.254: 89.45,30.26 86.47,30.26 R14.2 86.45,28.57 R12.2
$3N494: length 3.2
  Top Layer w0.254: 89.45,32.54 86.9,32.54 R10.2
$3N881: length 4.8
  Top Layer w0.254: R19.2 R21.2 67.84,30.33 U13.4
$3N886: length 3.3
  Top Layer w0.254: R17.2 65.41,32.57 U13.2
$3N1191: length 4.4
  Top Layer w0.254: R25.2 R27.2 43.42,30.24 U15.4
$3N1196: length 2.8
  Top Layer w0.254: R23.2 43.99,32.52 U15.2
$3N1501: length 4.5
  Top Layer w0.254: R13.2 91.64,43.87 R15.2 91.63,42.18 U11.4
$3N1506: length 2.9
  Top Layer w0.254: R11.2 91.22,39.9 U11.2
$3N1811: length 4.6
  Top Layer w0.254: U12.4 70.31,42.18 R20.2 70.33,43.98 R18.2
$3N1816: length 2.9
  Top Layer w0.254: R16.2 69.84,39.9 U12.2
$3N2121: length 4.6
  Top Layer w0.254: R24.2 R26.2 48.81,42.16 46.13,42.16
$3N2126: length 3
  Top Layer w0.254: R22.2 48.4,39.88 46.13,39.88

## Copper pours and planes (outline as drawn; the poured copper is in the pictures)
GND on Top Layer: -1.77,53.19 106.9,53.19 106.9,-6.09 -1.77,-6.09
GND on Bottom Layer: -2.93,53.91 105.27,53.91 105.27,-6.24 -2.93,-6.24
VCC on Top Layer: 36.33,38.82 99.22,38.82 99.22,33.87 36.33,33.87
OUT_1 on Top Layer: 90.17,34.09 92.71,34.09 92.71,26.75 90.17,26.75
OUT_2 on Top Layer: 68.6,34.11 71.14,34.11 71.14,26.78 68.6,26.78
OUT_3 on Top Layer: 46.88,34.07 49.42,34.07 49.42,26.73 46.88,26.73
OUT_4 on Top Layer: 85.66,45.69 88.2,45.69 88.2,38.35 85.66,38.35
OUT_5 on Top Layer: 64.35,45.69 66.89,45.69 66.89,38.36 64.35,38.36
OUT_6 on Top Layer: 42.87,45.67 45.41,45.67 45.41,38.33 42.87,38.33
$1N255 on Top Layer: 88.34,9.43 93.08,9.43 93.08,4.86 88.34,4.86
